# Altium schematic sheet 如意硬件电源模块0831.SchDoc
size A4
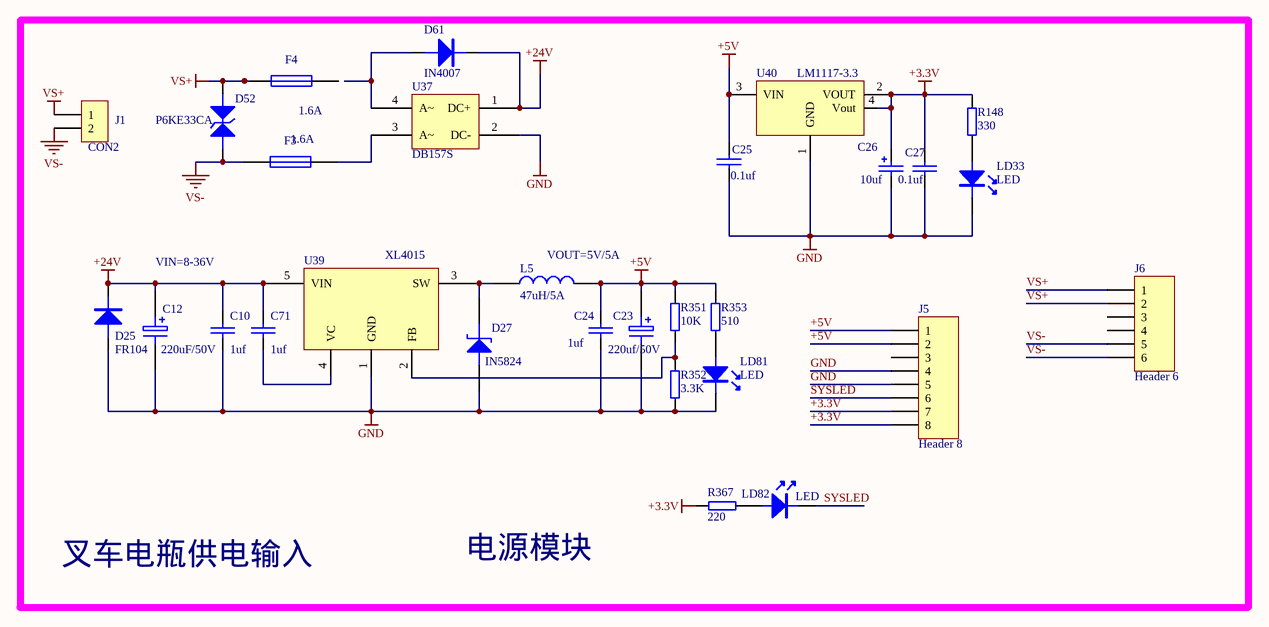
[diagram p0: 如意硬件电源模块0831.SchDoc]

## Parts
C10  1uf  [0805-1]
C12  220uF/50V  [C-RB-S10]
C23  220uf/50V  [C-RB-S10]
C24  1uf  [0805-1]
C25  0.1uf  [0805-1]
C26  10uf  [C-RB-S6]
C27  0.1uf  [0805-1]
C71  1uf  [0805-1]
D25  FR104  [DIODETP-5]
D27  IN5824  [SMB]
D52  P6KE33CA  [SMB]
D61  IN4007  [SMB]
F3  1.6A  [1812]
F4  1.6A  [1812]
J1  CON2  [JK126-2]
J5  Header 8  [HDR1X8]
J6  Header 6  [HDR1X6]
L5  47uH/5A  [L1-47uH/5A]
LD33  LED  [LED_Z1]
LD81  LED  [LED_Z1]
LD82  LED  [LED_Z1]
R148  330  [0805-1]
R351  10K  [0805-1]
R352  3.3K  [0805-1]
R353  510  [0805-1]
R367  220  [0805-1]
U37  DB157S  [SOP-DBS]
U39  XL4015  [TO-263-5]
U40  LM1117-3.3  [ASM1117]

## Nets
+3.3V: C26.1 C27.2 J5.7 J5.8 R148.1 R367.1 U40.2(VOUT) U40.4(Vout)
+5V: C23.1 C24.1 C25.2 J5.1 J5.2 L5.2 R351.1 R353.1 U40.3(VIN)
+24V: C10.1 C12.1 C71.1 D25.2 D61.2 U37.1(DC+) U39.5(VIN)
GND: C10.2 C12.2 C23.2 C24.2 C25.1 C26.2 C27.1 D25.1 D27.1(A) J5.4 J5.5 LD33.2 LD81.2 R352.2 U37.2(DC-) U39.1(GND) U40.1(GND)
VS+: D52.2(K) F4.1 J1.1 J6.1 J6.2
VS-: D52.1(A) F3.1 J1.2 J6.5 J6.6
SYSLED: J5.6 LD82.2
NetC71_2: C71.2 U39.4(VC)
NetD27_2: D27.2(K) L5.1 U39.3(SW)
NetD61_1: D61.1 U37.4(A~)
NetF3_2: F3.2 U37.3(A~)
NetLD33_1: LD33.1 R148.2
NetLD81_1: LD81.1 R353.2
NetLD82_1: LD82.1 R367.2
NetR351_2: R351.2 R352.1 U39.2(FB)

Not connected (* = marked no-connect by the designer): F4 2; J5 3; J6 3 4

## Notes on the sheet
- VIN=8-36V
- (near L5) VOUT=5V/5A
- 叉车电瓶供电输入
- 电源模块

## Library data of the parts
C10 C24 C71 = CAP: Capacitor
C12 C23 = ELECTRO1: Electrolytic Capacitor
C25 C27 = CAP0: CAP
C26 = ECAP
D25 D61 = DIODE
D27 = ZENER2: Zener Diode
D52 = TVS
F3 F4 = FUSE1: Fuse
J1 = CON2: Connector
J5 = Header 8: Header, 8-Pin; LatestRevisionDate: 17-Jul-2002; LatestRevisionNote: Re-released for DXP Platform.; Publisher: Altium Limited
J6 = Header 6: 接插件; LatestRevisionDate: 17-Jul-2002; LatestRevisionNote: Re-released for DXP Platform.; Publisher: Altium Limited
L5 = INDUCTOR
R148 R351-R353 R367 = RES-2
U37 = MB6S
U40 = LM1117